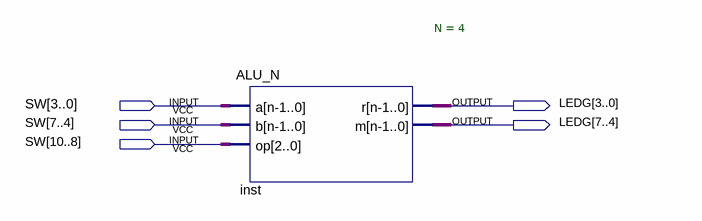
[diagram p0: schematic sheet]
// Quartus schematic ALUN.bdf as structural Verilog: 1 symbols, 5 pins
module ALUN (
  input  [10:0] SW,
  output [7:0] LEDG
);

  ALU_N #(.N(4)) inst (.a(SW[3:0]), .b(SW[7:4]), .op(SW[10:8]), .r(LEDG[3:0]), .m(LEDG[7:4]));
endmodule
